# Altium schematic sheet RS485.SchDoc
size 420 x 297 mm; SheetNumber: 6; SheetTotal: 6
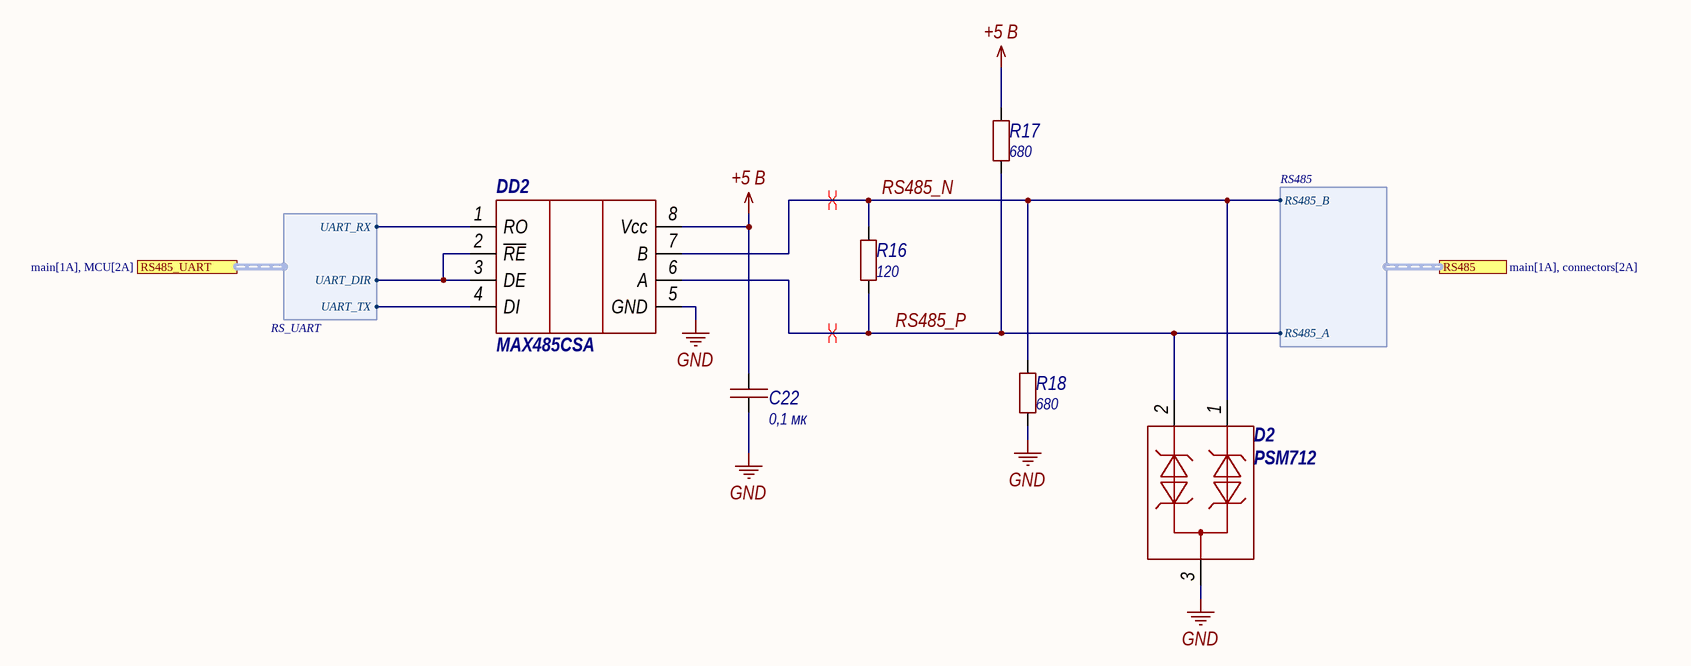
[diagram p0: RS485.SchDoc]

## Parts
C22  value 0,1 мк  [0603C]  (hidden comment: Capacitor)
D2  PSM712  [SOT23-3]
DD2  MAX485CSA  [SOIC-8]
R16  value 120  [1206R]  (hidden comment: Resistor)
R17  value 680  [0603R]  (hidden comment: Resistor)
R18  value 680  [0603R]  (hidden comment: Resistor)

## Ports
RS485 (harness RS485, see main[1A], connectors[2A]), RS485_UART (harness RS_UART, see main[1A], MCU[2A])

## Harnesses
RS485: RS485_B, RS485_A
RS_UART: UART_RX, UART_TX, UART_DIR

## Nets
+5 В: C22.2 DD2.8(Vcc) R17.2
GND: C22.1 D2.3 DD2.5(GND) R18.1
RS485_N: D2.1 DD2.7(B) R16.2 R18.2 ; port RS485.RS485_B
RS485_P: D2.2 DD2.6(A) R16.1 R17.1 ; port RS485.RS485_A
NetDD2_1: DD2.1(RO) ; port RS485_UART.UART_RX
NetDD2_2: DD2.2(~{RE}) DD2.3(DE) ; port RS485_UART.UART_DIR
NetDD2_4: DD2.4(DI) ; port RS485_UART.UART_TX

## Layout directives
differential pair: RS485_N, RS485_P

## Notes on the sheet
- Перв. примен.
- Справ. №
- Подп. и дата
- Инв. № дубл.
- Взам. инв. №
- Разраб.
- Изм.
- Лист
- № докум.
- Подп.
- Дата
- Лит.
- Масса
- Масштаб
- Пров.
- Т.контр.
- Схема электрическая принципиальная
- Листов
- Инв. № подл.
- Утв.
- Н.контр.
- Копировал
- Формат А3

## Library data of the parts
C22 = Capacitor_0,1u_10_50V_X7R_0603C: Конденсатор 0603C ёмкостью 0,1 мк 10%, 50 В, X7R; Voltage (V): 50; Capacity (nF): 100; Part Number: Capacitor_0,1u_10_50V_X7R_0603C; Tolerance: 10%; Dielectric: X7R
D2 = PSM712: Защитный диод для линии RS-485; Part Number: PSM712; Interface: RS-485
DD2 = MAX485CSA: RS-485 приёмопередатчик; Part Number: MAX485CSA
R16 = Resistor_120_1_0603: Резистор номиналом 120 Ом 1%; Power: *; Part Number: Resistor_120_1_0603; Tolerance: 1%
R17 R18 = Resistor_680_1_0603: Резистор номиналом 680 Ом 1%; Power: *; Part Number: Resistor_680_1_0603; Tolerance: 1%